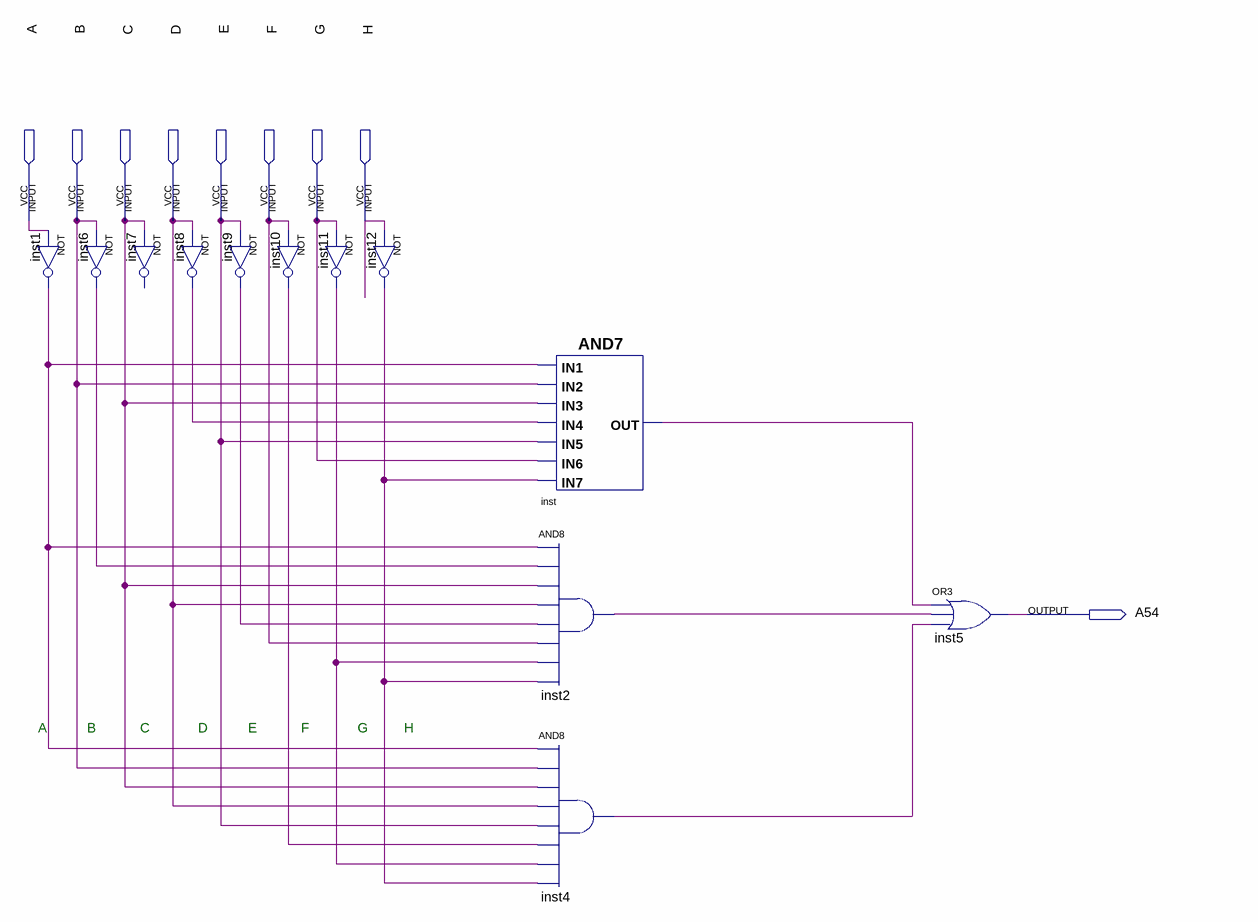
[diagram p0: schematic sheet]
// Quartus schematic A54.bdf as structural Verilog: 12 symbols, 9 pins
module A54 (
  input  A,
  input  B,
  input  C,
  input  D,
  input  E,
  input  F,
  input  G,
  input  H,
  output A54
);

  wire inst1_out, inst2_out, inst4_out, inst6_out, inst8_out, inst9_out, inst10_out, inst11_out, inst12_out,
       inst_out;

  not inst1 (inst1_out, A);
  not inst6 (inst6_out, B);
  // NOT inst7 has open pins: IN=C, OUT=open
  not inst8 (inst8_out, D);
  not inst9 (inst9_out, E);
  not inst10 (inst10_out, F);
  not inst11 (inst11_out, G);
  not inst12 (inst12_out, H);
  and inst (inst_out, inst1_out, B, C, inst8_out, E, G, inst12_out);
  and inst2 (inst2_out, inst1_out, inst6_out, C, D, inst9_out, F, inst11_out, inst12_out);
  and inst4 (inst4_out, inst1_out, B, C, D, E, inst10_out, inst11_out, inst12_out);
  or inst5 (A54, inst_out, inst2_out, inst4_out);

  // Notes on the sheet:
  //   A          B           C            D          E           F            G         H
endmodule
